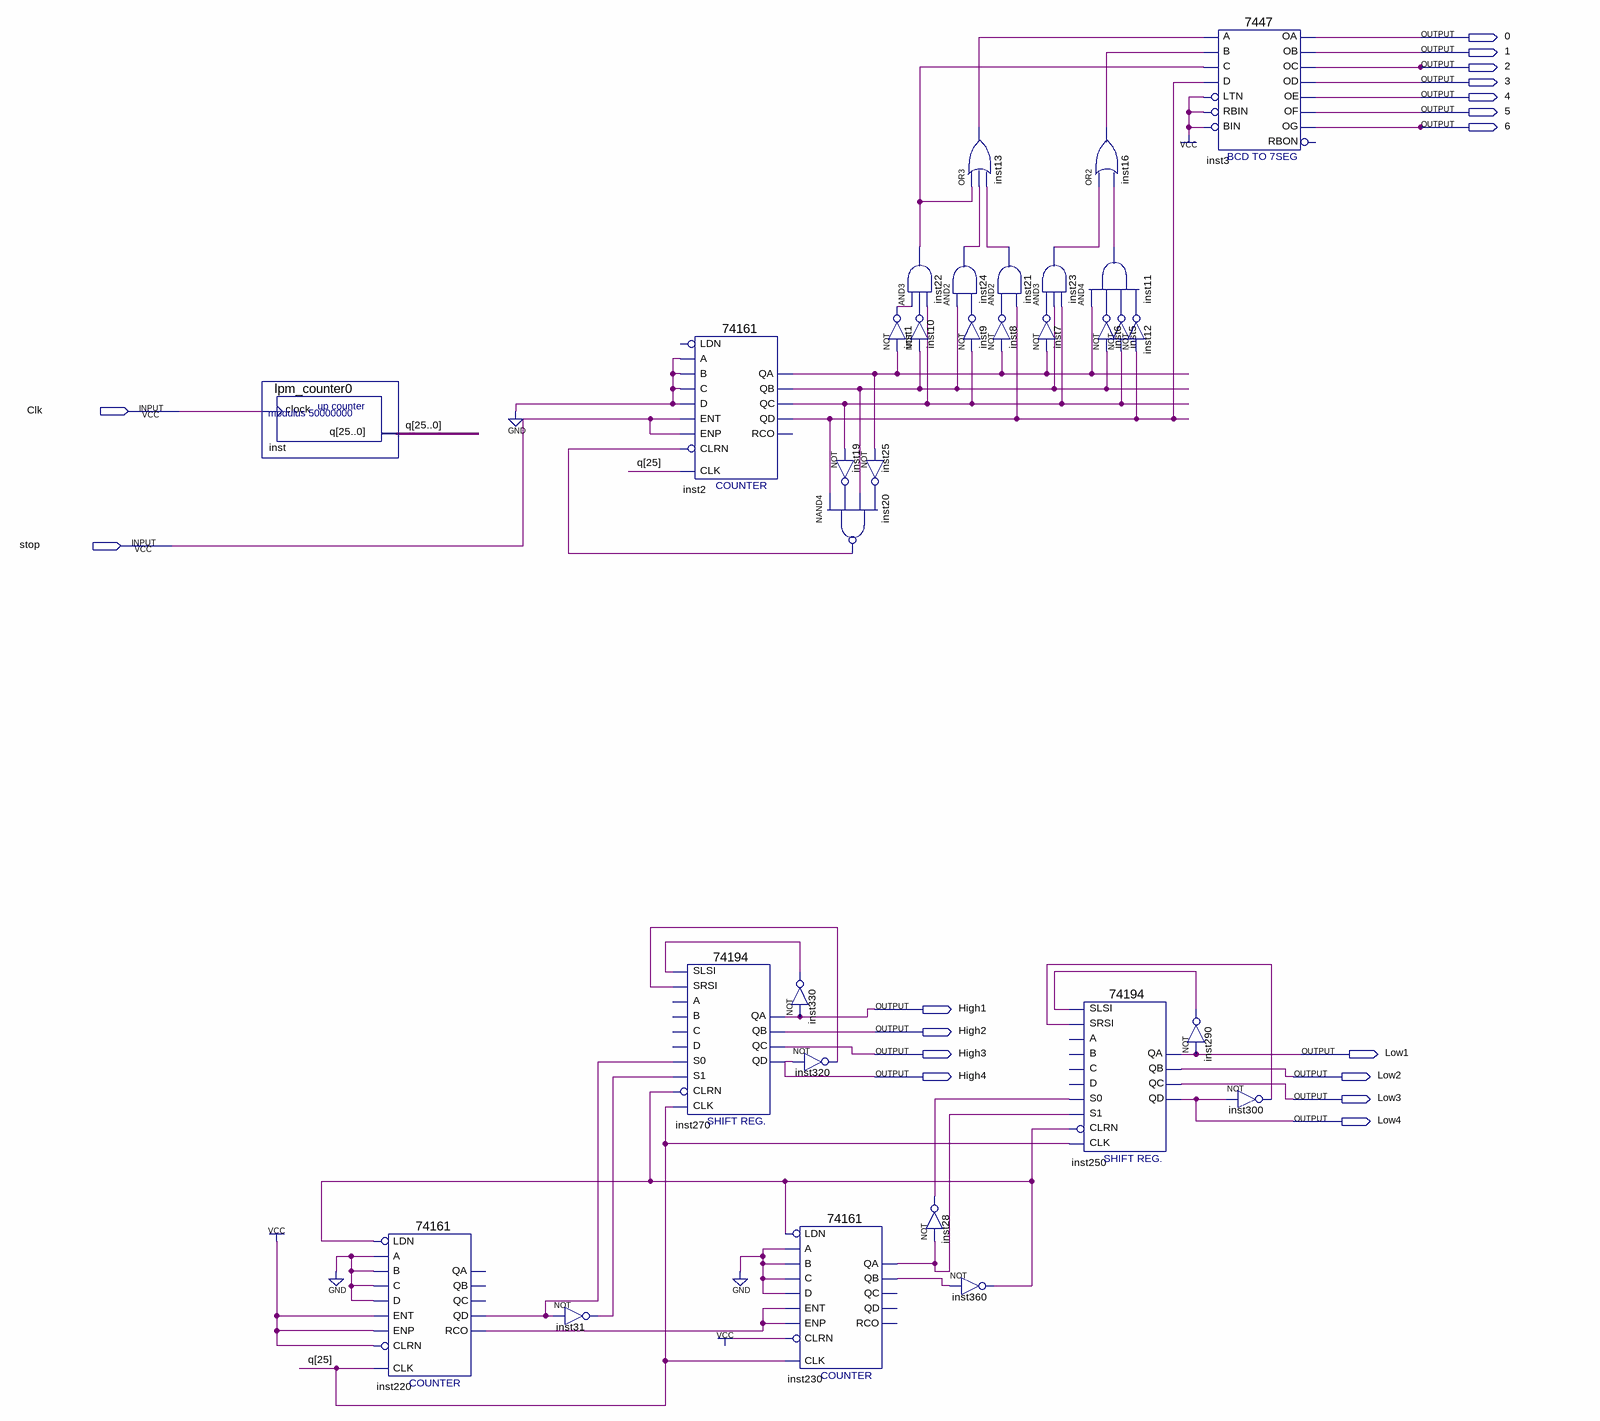
[diagram p0: schematic sheet]
// Quartus schematic 3-2-0.bdf as structural Verilog: 32 symbols, 17 pins
module \3-2-0  (
  input  Clk,
  input  stop,
  output \0 ,
  output \1 ,
  output \2 ,
  output \3 ,
  output \4 ,
  output \5 ,
  output \6 ,
  output High1,
  output High2,
  output High3,
  output Low1,
  output High4,
  output Low2,
  output Low3,
  output Low4
);

  wire inst1_out, inst2_qa, inst2_qb, inst2_qc, inst2_qd, inst5_out, inst6_out, inst7_out, inst8_out,
       inst9_out, inst10_out, inst11_out, inst12_out, inst13_out, inst16_out, inst19_out, inst20_out,
       inst21_out, inst22_out, inst23_out, inst24_out, inst25_out, inst28_out, inst31_out, inst220_qd,
       inst220_rco, inst230_qa, inst230_qb, inst290_out, inst300_out, inst320_out, inst330_out, inst360_out;
  wire [25:0] q;

  lpm_counter0 inst (.clock(Clk), .q(q));
  \74161  inst220 (
    .CLRN(1'b1), .CLK(q[25]), .ENP(1'b1), .LDN(inst360_out), .A(1'b0), .D(1'b0), .ENT(1'b1), .B(1'b0),
    .C(1'b0), .QD(inst220_qd), .RCO(inst220_rco));  // open: QC, QB, QA
  not inst31 (inst31_out, inst220_qd);
  \74161  inst2 (
    .CLRN(inst20_out), .CLK(q[25]), .ENP(stop), .A(1'b0), .D(1'b0), .ENT(stop), .B(1'b0), .C(1'b0),
    .QD(inst2_qd), .QC(inst2_qc), .QB(inst2_qb), .QA(inst2_qa));  // open: LDN, RCO
  \74194  inst270 (
    .SLSI(inst330_out), .SRSI(inst320_out), .CLK(q[25]), .CLRN(inst360_out), .S1(inst31_out),
    .S0(inst220_qd), .QA(High1), .QB(High2), .QC(High3), .QD(High4));  // open: B, C, D, A
  not inst330 (inst330_out, High1);
  not inst320 (inst320_out, High4);
  \74161  inst230 (
    .CLRN(1'b1), .CLK(q[25]), .ENP(inst220_rco), .LDN(inst360_out), .A(1'b0), .D(1'b0), .ENT(inst220_rco),
    .B(1'b0), .C(1'b0), .QB(inst230_qb), .QA(inst230_qa));  // open: QD, QC, RCO
  not inst19 (inst19_out, inst2_qc);
  not inst25 (inst25_out, inst2_qa);
  nand inst20 (inst20_out, inst2_qd, inst19_out, inst2_qb, inst25_out);
  and inst22 (inst22_out, inst1_out, inst10_out, inst2_qc);
  not inst1 (inst1_out, inst2_qa);
  not inst10 (inst10_out, inst2_qb);
  not inst28 (inst28_out, inst230_qa);
  or inst13 (inst13_out, inst22_out, inst24_out, inst21_out);
  and inst24 (inst24_out, inst2_qb, inst9_out);
  not inst9 (inst9_out, inst2_qc);
  not inst360 (inst360_out, inst230_qb);
  and inst21 (inst21_out, inst8_out, inst2_qd);
  and inst23 (inst23_out, inst7_out, inst2_qb, inst2_qc);
  not inst7 (inst7_out, inst2_qa);
  not inst8 (inst8_out, inst2_qa);
  or inst16 (inst16_out, inst23_out, inst11_out);
  and inst11 (inst11_out, inst2_qa, inst6_out, inst5_out, inst12_out);
  not inst6 (inst6_out, inst2_qb);
  \74194  inst250 (
    .SLSI(inst290_out), .SRSI(inst300_out), .CLK(q[25]), .CLRN(inst360_out), .S1(inst230_qa),
    .S0(inst28_out), .QA(Low1), .QB(Low2), .QC(Low3), .QD(Low4));  // open: B, C, D, A
  not inst5 (inst5_out, inst2_qc);
  not inst12 (inst12_out, inst2_qd);
  \7447  inst3 (
    .LTN(1'b1), .B(inst16_out), .C(inst22_out), .D(inst2_qd), .RBIN(1'b1), .BIN(1'b1), .A(inst13_out),
    .OB(\1 ), .OC(\2 ), .OE(\4 ), .OD(\3 ), .OF(\5 ), .OG(\6 ), .OA(\0 ));  // open: RBON
  not inst290 (inst290_out, Low1);
  not inst300 (inst300_out, Low4);
endmodule
